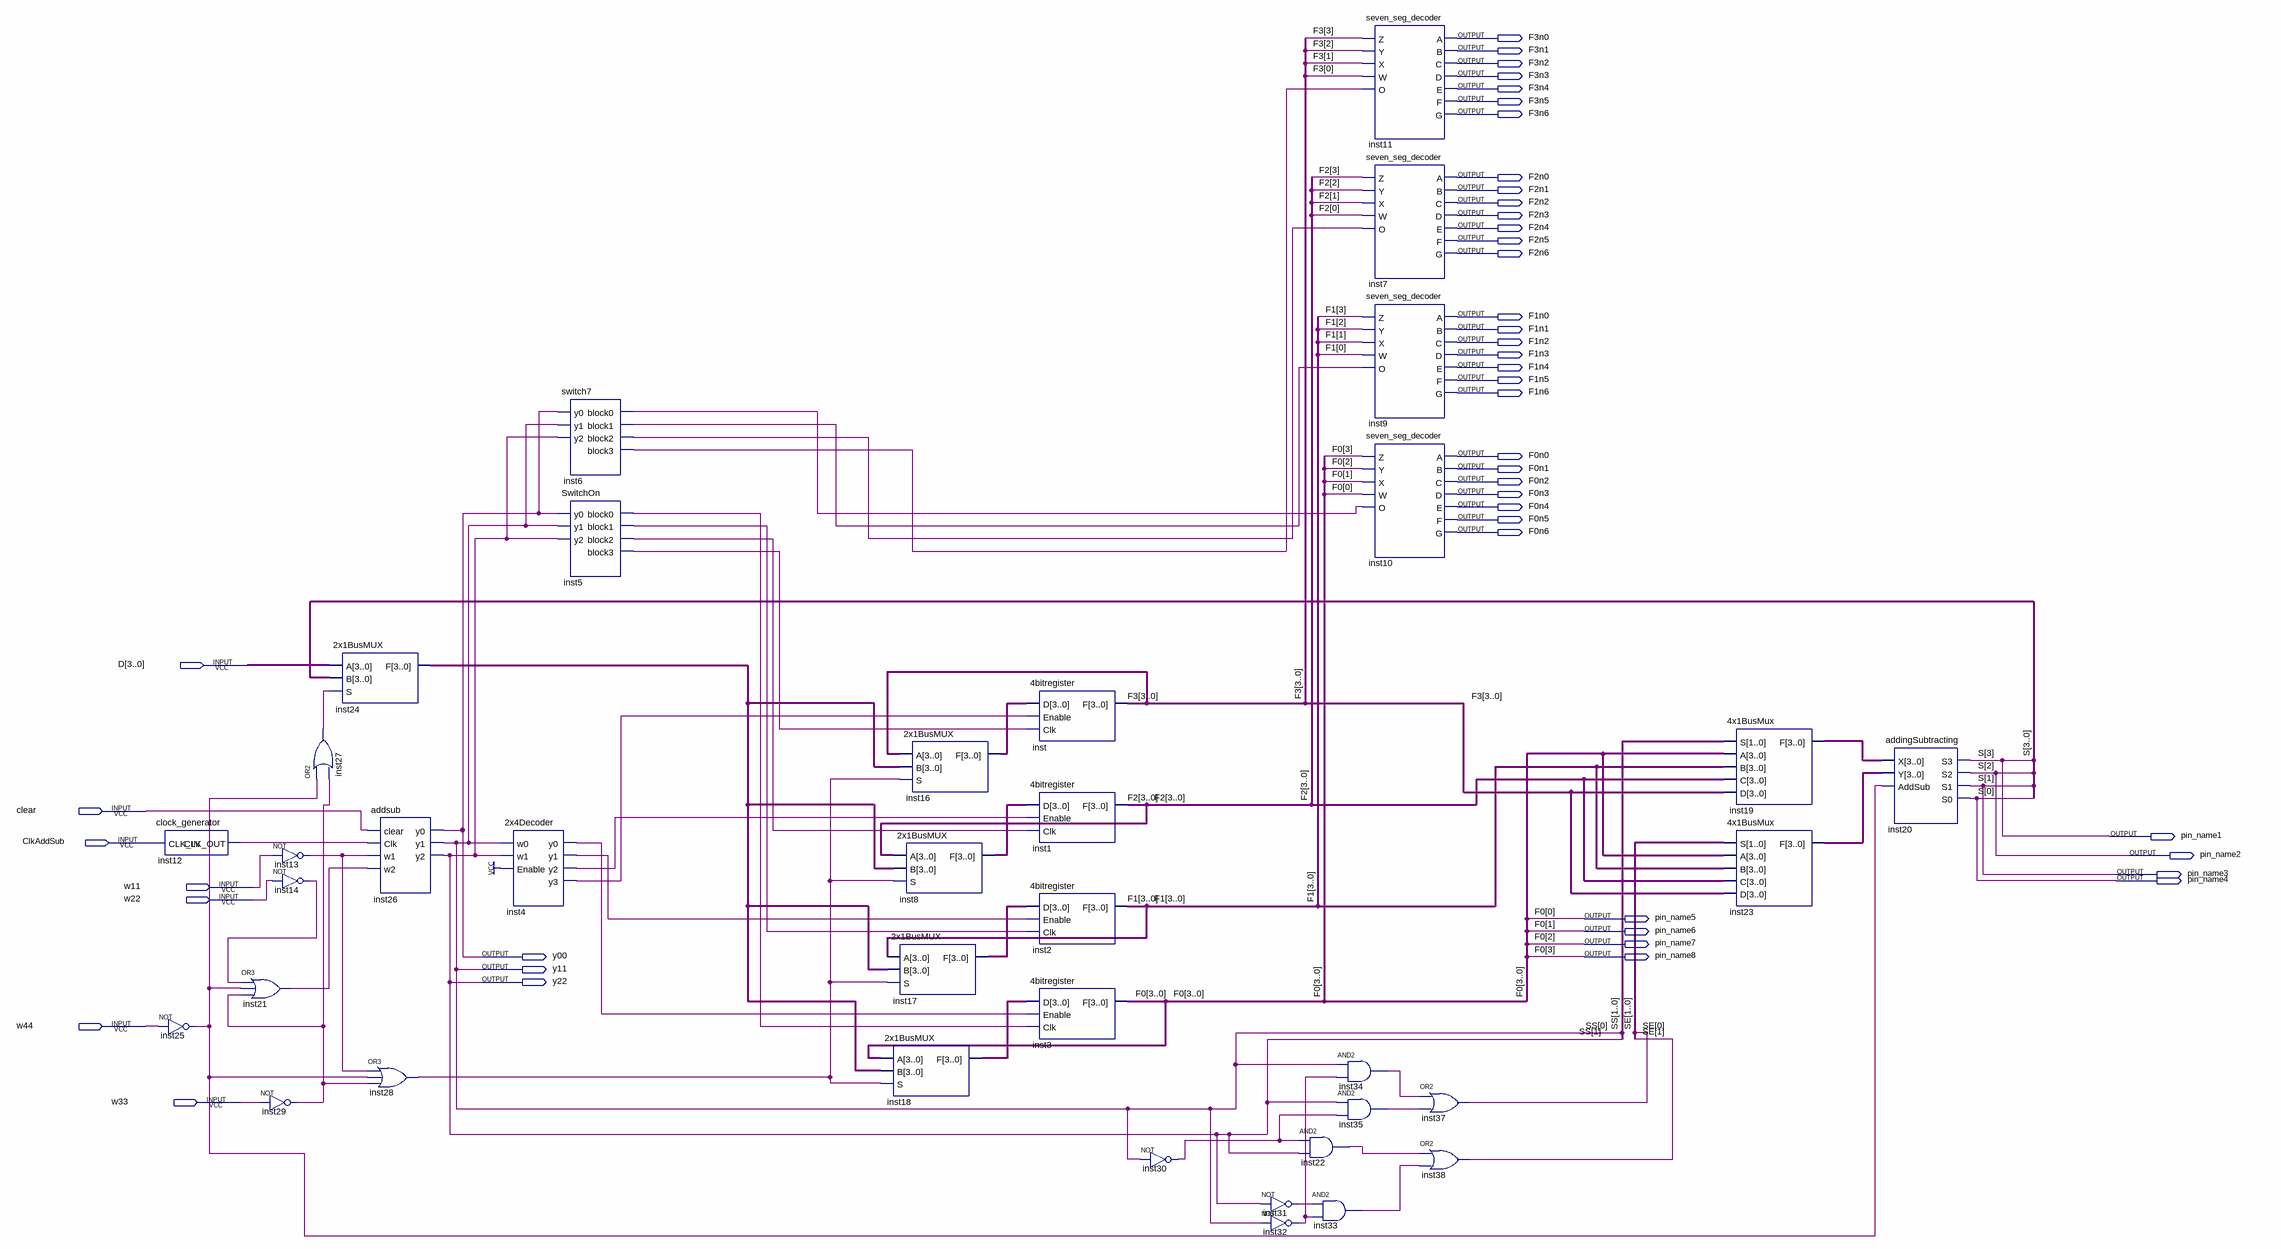
[diagram p0: schematic sheet]
// Quartus schematic check.bdf as structural Verilog: 37 symbols, 46 pins
module check (
  input  [3:0] D,
  input  clear,
  input  ClkAddSub,
  input  w11,
  input  w22,
  input  w44,
  input  w33,
  output F3n0,
  output F3n1,
  output F3n2,
  output F3n3,
  output F3n4,
  output F3n5,
  output F3n6,
  output F2n0,
  output F2n1,
  output F2n2,
  output F2n3,
  output F2n4,
  output F2n5,
  output F2n6,
  output F1n0,
  output F1n1,
  output F1n2,
  output F1n3,
  output F1n4,
  output F1n5,
  output F1n6,
  output F0n0,
  output F0n1,
  output F0n2,
  output F0n3,
  output F0n4,
  output F0n5,
  output F0n6,
  output pin_name1,
  output pin_name2,
  output pin_name3,
  output pin_name4,
  output pin_name5,
  output pin_name6,
  output pin_name7,
  output y00,
  output pin_name8,
  output y11,
  output y22
);

  wire inst4_y0, inst4_y1, inst4_y2, inst4_y3, inst5_block0, inst5_block1, inst5_block2, inst5_block3,
       inst6_block0, inst6_block1, inst6_block2, inst6_block3, inst12_clk_out, inst13_out, inst14_out,
       inst21_out, inst22_out, inst25_out, inst27_out, inst28_out, inst29_out, inst30_out, inst31_out,
       inst32_out, inst33_out, inst34_out, inst35_out;
  wire [1:0] SE;
  wire [3:0] F1, F2, F3, inst8_f, inst16_f, inst17_f, inst18_f, inst19_f, inst23_f, inst24_f;

  clock_generator inst12 (.CLK_IN(ClkAddSub), .CLK_OUT(inst12_clk_out));
  not inst25 (inst25_out, w44);
  not inst13 (inst13_out, w11);
  not inst14 (inst14_out, w22);
  or inst21 (inst21_out, inst14_out, inst25_out, inst29_out);
  not inst29 (inst29_out, w33);
  \2x1BusMUX  inst24 (.A(D), .B({pin_name1, pin_name2, pin_name3, pin_name4}), .S(inst27_out), .F(inst24_f));
  or inst27 (inst27_out, inst25_out, inst29_out);
  addsub inst26 (.clear(clear), .Clk(inst12_clk_out), .w1(inst13_out), .w2(inst21_out), .y0(y00), .y1(y11), .y2(y22));
  or inst28 (inst28_out, inst13_out, inst25_out, inst29_out);
  \2x4Decoder  inst4 (.w0(y11), .w1(y22), .Enable(1'b1), .y0(inst4_y0), .y1(inst4_y1), .y2(inst4_y2), .y3(inst4_y3));
  switch7 inst6 (
    .y0(y00), .y1(y11), .y2(y22), .block0(inst6_block0), .block1(inst6_block1), .block2(inst6_block2),
    .block3(inst6_block3));
  SwitchOn inst5 (
    .y0(y00), .y1(y11), .y2(y22), .block0(inst5_block0), .block1(inst5_block1), .block2(inst5_block2),
    .block3(inst5_block3));
  \2x1BusMUX  inst8 (.A(F2), .B(inst24_f), .S(inst28_out), .F(inst8_f));
  \2x1BusMUX  inst17 (.A(F1), .B(inst24_f), .S(inst28_out), .F(inst17_f));
  \2x1BusMUX  inst18 (.A({pin_name8, pin_name7, pin_name6, pin_name5}), .B(inst24_f), .S(inst28_out), .F(inst18_f));
  \2x1BusMUX  inst16 (.A(F3), .B(inst24_f), .S(inst28_out), .F(inst16_f));
  \4bitregister  inst (.D(inst16_f), .Enable(inst4_y3), .Clk(inst5_block3), .F(F3));
  \4bitregister  inst1 (.D(inst8_f), .Enable(inst4_y2), .Clk(inst5_block2), .F(F2));
  \4bitregister  inst2 (.D(inst17_f), .Enable(inst4_y1), .Clk(inst5_block1), .F(F1));
  \4bitregister  inst3 (
    .D(inst18_f), .Enable(inst4_y0), .Clk(inst5_block0), .F({pin_name8, pin_name7, pin_name6, pin_name5}));
  not inst30 (inst30_out, y11);
  and inst22 (inst22_out, inst30_out, y22);
  not inst31 (inst31_out, y22);
  not inst32 (inst32_out, y11);
  and inst34 (inst34_out, y11, inst32_out);
  and inst35 (inst35_out, y22, inst30_out);
  and inst33 (inst33_out, inst31_out, inst32_out);
  seven_seg_decoder inst11 (
    .Z(F3[3]), .Y(F3[2]), .X(F3[1]), .W(F3[0]), .O(inst6_block3), .A(F3n0), .B(F3n1), .C(F3n2), .D(F3n3),
    .E(F3n4), .F(F3n5), .G(F3n6));
  seven_seg_decoder inst7 (
    .Z(F2[3]), .Y(F2[2]), .X(F2[1]), .W(F2[0]), .O(inst6_block2), .A(F2n0), .B(F2n1), .C(F2n2), .D(F2n3),
    .E(F2n4), .F(F2n5), .G(F2n6));
  seven_seg_decoder inst9 (
    .Z(F1[3]), .Y(F1[2]), .X(F1[1]), .W(F1[0]), .O(inst6_block1), .A(F1n0), .B(F1n1), .C(F1n2), .D(F1n3),
    .E(F1n4), .F(F1n5), .G(F1n6));
  seven_seg_decoder inst10 (
    .Z(pin_name8), .Y(pin_name7), .X(pin_name6), .W(pin_name5), .O(inst6_block0), .A(F0n0), .B(F0n1),
    .C(F0n2), .D(F0n3), .E(F0n4), .F(F0n5), .G(F0n6));
  or inst37 (SE[0], inst34_out, inst35_out);
  or inst38 (SE[1], inst22_out, inst33_out);
  \4x1BusMux  inst19 (
    .S({y22, y11}), .A({pin_name8, pin_name7, pin_name6, pin_name5}), .B(F1), .C(F2), .D(F3), .F(inst19_f));
  \4x1BusMux  inst23 (.S(SE), .A({pin_name8, pin_name7, pin_name6, pin_name5}), .B(F1), .C(F2), .D(F3), .F(inst23_f));
  addingSubtracting inst20 (
    .X(inst19_f), .Y(inst23_f), .AddSub(inst25_out), .S3(pin_name1), .S2(pin_name2), .S1(pin_name3),
    .S0(pin_name4));

  // Other names for the same wires on the sheet: F0[3:0] = {pin_name8, pin_name7, pin_name6, pin_name5};
  //   S[3:0] = {pin_name1, pin_name2, pin_name3, pin_name4}; SS[1:0] = {y22, y11}
endmodule
